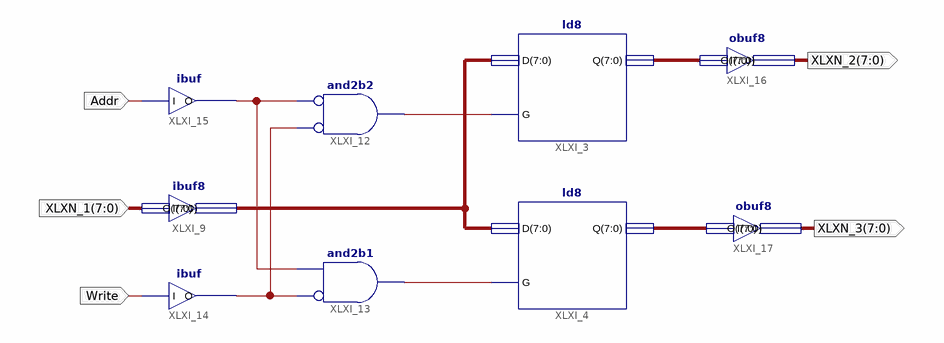
[diagram p0: schematic sheet 1]
// Xilinx ISE schematic Dual_Latch.sch (xbr) as structural Verilog: 9 symbols, 5 ports
module Dual_Latch (
  input  [7:0] XLXN_1,
  input  Addr,
  input  Write,
  output [7:0] XLXN_2,
  output [7:0] XLXN_3
);

  wire XLXN_7, XLXN_8, XLXN_9, XLXN_10;
  wire [7:0] XLXN_5, XLXN_6, XLXN_13;

  ibuf8 XLXI_9 (.I(XLXN_1), .O(XLXN_13));
  ld8 XLXI_3 (.D(XLXN_13), .G(XLXN_7), .Q(XLXN_5));
  ld8 XLXI_4 (.D(XLXN_13), .G(XLXN_8), .Q(XLXN_6));
  and XLXI_12 (XLXN_7, ~XLXN_9, ~XLXN_10);  // and2b2
  and XLXI_13 (XLXN_8, ~XLXN_9, XLXN_10);  // and2b1
  ibuf XLXI_14 (.I(Write), .O(XLXN_9));
  ibuf XLXI_15 (.I(Addr), .O(XLXN_10));
  obuf8 XLXI_16 (.I(XLXN_5), .O(XLXN_2));
  obuf8 XLXI_17 (.I(XLXN_6), .O(XLXN_3));
endmodule
